# Altium schematic sheet KNX-MultiExt_2.SchDoc
size A4
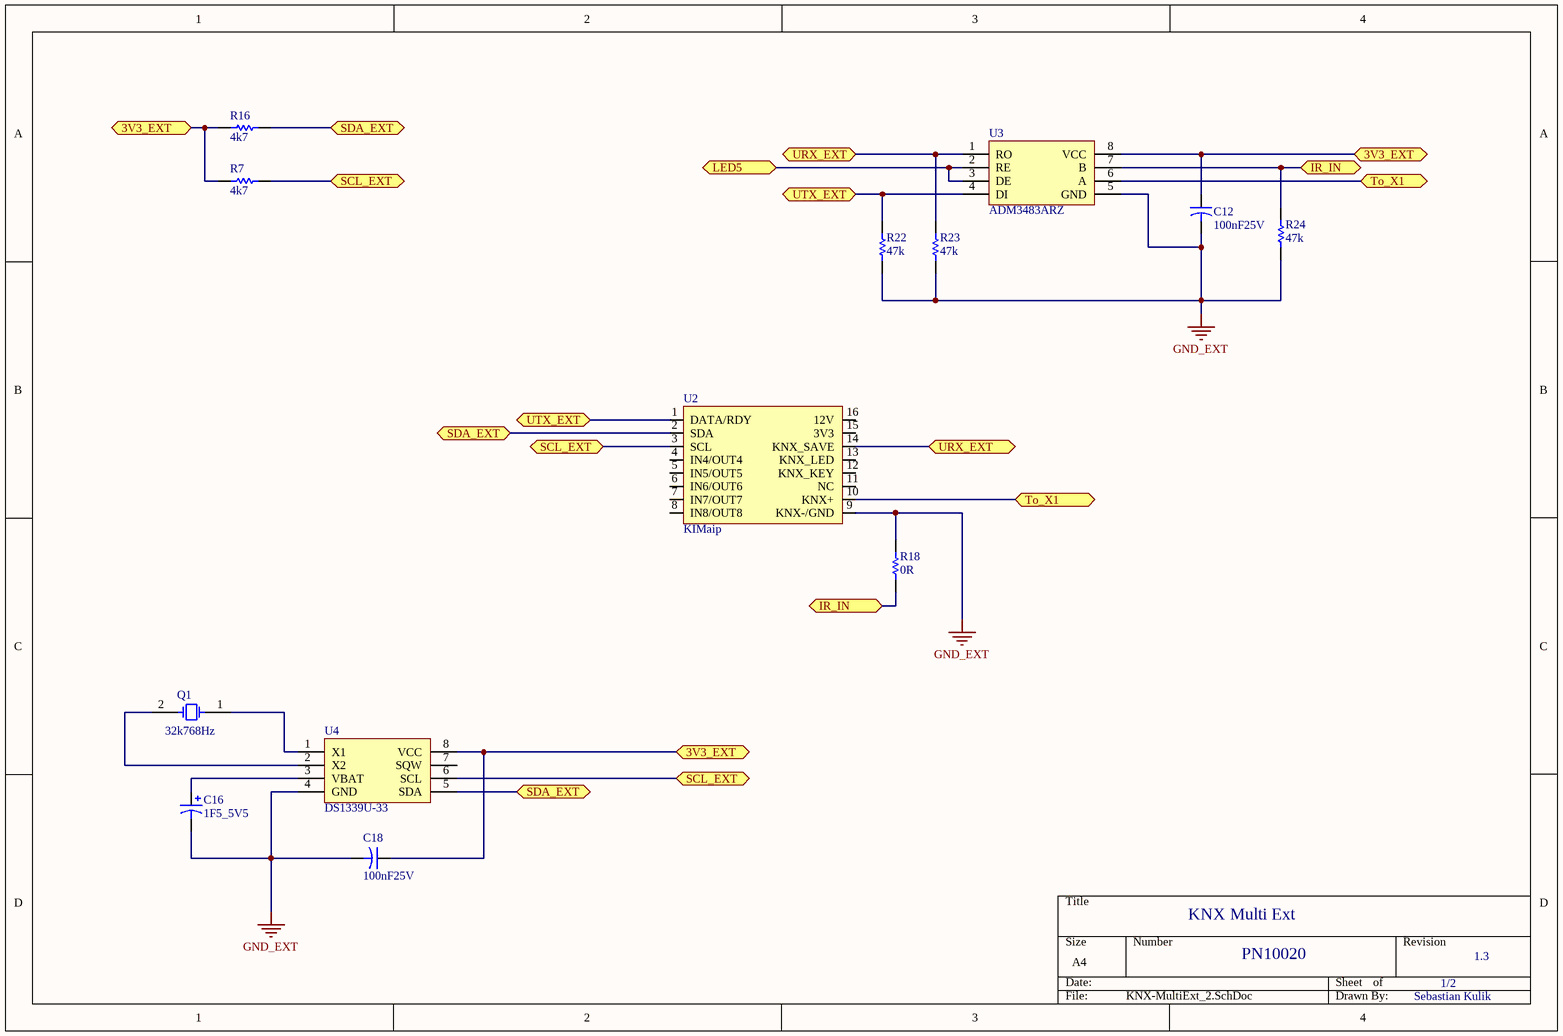
[diagram p0: KNX-MultiExt_2.SchDoc]

## Parts
C12  value 100nF25V  [C0402]  (hidden comment: 100nF25V_0402)
C16  value 1F5_5V5  [Goldcap_B]  (hidden comment: 1F5_5V5_POL)
C18  value 100nF25V  [C0402]  (hidden comment: 100nF25V_0402)
Q1  value 32k768Hz  [VT-200]  (hidden comment: Crystal_32k768Hz)
R7  value 4k7  [R0402]  (hidden comment: 4k7_0402)
R16  value 4k7  [R0402]  (hidden comment: 4k7_0402)
R18  value 0R  [R0603(1608)]  (hidden comment: 0R_0603)
R22  value 47k  [R0402]  (hidden comment: 47k_0402)
R23  value 47k  [R0402]  (hidden comment: 47k_0402)
R24  value 47k  [R0402]  (hidden comment: 47k_0402)
U2  KIMaip  [KIMaip]
U3  ADM3483ARZ  [SOIC8_N]
U4  DS1339U-33  [uSOP8]

## Ports
3V3_EXT, IR_IN, LED5, SCL_EXT, SDA_EXT, To_X1, URX_EXT, UTX_EXT

## Nets
GND_EXT: C12.2 C16.2 C18.2 R18.2 R22.1 R23.1 R24.1 U2.9(KNX-/GND) U3.5(GND) U4.4(GND)
3V3_EXT: C12.1 C18.1 R7.1 R16.1 U3.8(VCC) U4.8(VCC) ; port 3V3_EXT
IR_IN: R18.1 R24.2 U3.7(B) ; port IR_IN
LED5: U3.2(RE) U3.3(DE) ; port LED5
SCL_EXT: R7.2 U2.3(SCL) U4.6(SCL) ; port SCL_EXT
SDA_EXT: R16.2 U2.2(SDA) U4.5(SDA) ; port SDA_EXT
To_X1: U2.10(KNX+) U3.6(A) ; port To_X1
URX_EXT: R23.2 U2.14(KNX_SAVE) U3.1(RO) ; port URX_EXT
UTX_EXT: R22.2 U2.1(DATA/RDY) U3.4(DI) ; port UTX_EXT
NetC16_1: C16.1 U4.3(VBAT)
NetQ1_1: Q1.1(E/D) U4.1(X1)
NetQ1_2: Q1.2(GND) U4.2(X2)

Not connected (* = marked no-connect by the designer): U2 4(IN4/OUT4) 5(IN5/OUT5) 6(IN6/OUT6) 7(IN7/OUT7) 8(IN8/OUT8) 11(NC) 12(KNX_KEY) 13(KNX_LED) 15(3V3) 16(12V); U4 7(SQW)

## Notes on the sheet
- KNX Multi Ext
- PN10020
- 1/2
- 1.3
- Sebastian Kulik

## Library data of the parts
C12 C18 = 100nF25V_0402: AVX, X5R, 10%, 25V; Deliverer PartNr: 1833862; Manufacturer PartNr: 04023D104KAT2A; Deliverer: Farnell; TDE-PN: C0036; Published: 09.12.2014; Part Description: AVX, X5R, 10%, 25V; Publisher: Sebastian Kulik; PackageDescription: C0402; Manufacturer: AVX
C16 = 1F5_5V5_POL: Panasonic, F series; Deliverer PartNr: 1305065; Manufacturer PartNr: EECF5R5U155; Deliverer: Farnell; TDFE-PN: C0042; Published: 26.02.2014; Part Description: Panasonic, F series; Publisher: Sebastian Kulik; PackageDescription: Goldcap-B; Manufacturer: Panasonic
Q1 = Crystal_32k768Hz: Crystal, 32.768kHz; Deliverer PartNr: 1607117; Manufacturer PartNr: VT-200-F; Manufacturer: Seiko; Deliverer: Farnell; TDE-PN: P0018; Published: 14.02.2014; PackageReference: VT-200; Publisher: Sebastian Kulik
R7 R16 = 4k7_0402: Vishay CRCW series, 63mW, 1%; Manufacturer PartNr: CRCW04024K70FKED; Deliverer PartNr: 2121688; TDE-PN: R0009; Deliverer: Farnell; Published: 25.02.2014; PackageReference: 0402; Publisher: Sebastian Kulik; PackageDescription: 0402; Manufacturer: Vishay; Part Description: Vishay CRCW series, 63mW, 1%
R18 = 0R_0603: Vishay, CRCW series, 100mW; Manufacturer PartNr: CRCW06030000ZSTA; Deliverer PartNr: 1652824; TDE-PN: R0041; Deliverer: Farnell; Published: 18.02.2014; Publisher: Sebastian Kulik; PackageDescription: 0603; Manufacturer: Vishay; Part Desicription: Vishay, CRCW series, 100mW
R22-R24 = 47k_0402: Vishay CRCW series, 63mW, 1%; Manufacturer PartNr: CRCW040247K0JNEAIF; Deliverer PartNr: 1739115; TDE-PN: R0020; Deliverer: Farnell; Published: 07.04.2014; PackageReference: 0402; Publisher: Sebastian Kulik; PackageDescription: 0402; Manufacturer: Vishay; Part Description: Vishay CRCW series, 63mW, 1%
U2 = KIMaip: PoE, 12V; Manufacturer: Tapko; TDE-PN: IC0040; Published: 25.02.2014; Deliverer PartNr: -; Deliverer: -; PackageReference: TSSOP8; Publisher: Sebastian Kulik; Manufacturer PartNr: KIMaip
U3 = ADM3483ARZ: Transceiver, RS485/422; Deliverer PartNr: 1274169; Manufacturer: ADI; Deliverer: Farnell; TDE-PN: IC0041; Published: 25.02.2014; PackageReference: TSSOP8; Publisher: Sebastian Kulik; Manufacturer PartNr: ADM3483ARZ
U4 = DS1339U-33: RTC; Deliverer PartNr: 1379717; Manufacturer: Dallas; Deliverer: Farnell; TDE-PN: IC0042; Published: 25.02.2014; PackageReference: TSSOP8; Publisher: Sebastian Kulik; Manufacturer PartNr: DS1339U-33